# EAGLE design 8_R_G_B_LEDs (EAGLE 6.4)
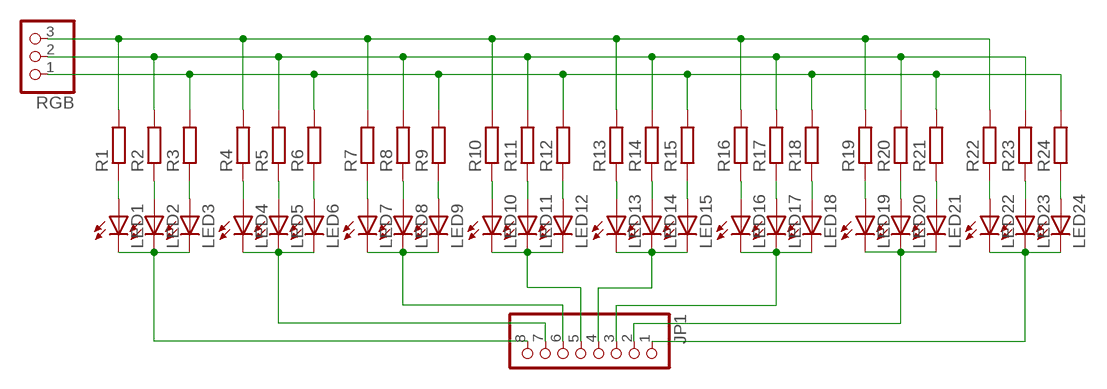
[diagram p0: schematic, sheet 1]

## Parts
JP1  PINHD-1X8  [1X08]
LED1  LED5MM  [LED5MM]
LED2  LED5MM  [LED5MM]
LED3  LED5MM  [LED5MM]
LED4  LED5MM  [LED5MM]
LED5  LED5MM  [LED5MM]
LED6  LED5MM  [LED5MM]
LED7  LED5MM  [LED5MM]
LED8  LED5MM  [LED5MM]
LED9  LED5MM  [LED5MM]
LED10  LED5MM  [LED5MM]
LED11  LED5MM  [LED5MM]
LED12  LED5MM  [LED5MM]
LED13  LED5MM  [LED5MM]
LED14  LED5MM  [LED5MM]
LED15  LED5MM  [LED5MM]
LED16  LED5MM  [LED5MM]
LED17  LED5MM  [LED5MM]
LED18  LED5MM  [LED5MM]
LED19  LED5MM  [LED5MM]
LED20  LED5MM  [LED5MM]
LED21  LED5MM  [LED5MM]
LED22  LED5MM  [LED5MM]
LED23  LED5MM  [LED5MM]
LED24  LED5MM  [LED5MM]
R1  R-EU_0207/7  [0207/7]
R2  R-EU_0207/7  [0207/7]
R3  R-EU_0207/7  [0207/7]
R4  R-EU_0207/7  [0207/7]
R5  R-EU_0207/7  [0207/7]
R6  R-EU_0207/7  [0207/7]
R7  R-EU_0207/7  [0207/7]
R8  R-EU_0207/7  [0207/7]
R9  R-EU_0207/7  [0207/7]
R10  R-EU_0207/7  [0207/7]
R11  R-EU_0207/7  [0207/7]
R12  R-EU_0207/7  [0207/7]
R13  R-EU_0207/7  [0207/7]
R14  R-EU_0207/7  [0207/7]
R15  R-EU_0207/7  [0207/7]
R16  R-EU_0207/7  [0207/7]
R17  R-EU_0207/7  [0207/7]
R18  R-EU_0207/7  [0207/7]
R19  R-EU_0207/7  [0207/7]
R20  R-EU_0207/7  [0207/7]
R21  R-EU_0207/7  [0207/7]
R22  R-EU_0207/7  [0207/7]
R23  R-EU_0207/7  [0207/7]
R24  R-EU_0207/7  [0207/7]
RGB  PINHD-1X3  [1X03]

## Nets
N$1: R1.2 R4.2 R7.2 R10.2 R13.2 R16.2 R19.2 R22.2 RGB.3
N$2: R2.2 R5.2 R8.2 R11.2 R14.2 R17.2 R20.2 R23.2 RGB.2
N$3: R3.2 R6.2 R9.2 R12.2 R15.2 R18.2 R21.2 R24.2 RGB.1
N$4: LED1.A R1.1
N$5: LED2.A R2.1
N$6: LED3.A R3.1
N$7: JP1.8 LED1.K(C) LED2.K(C) LED3.K(C)
N$8: JP1.7 LED4.K(C) LED5.K(C) LED6.K(C)
N$9: JP1.6 LED7.K(C) LED8.K(C) LED9.K(C)
N$10: JP1.5 LED10.K(C) LED11.K(C) LED12.K(C)
N$11: LED4.A R4.1
N$12: LED5.A R5.1
N$13: LED6.A R6.1
N$14: JP1.4 LED13.K(C) LED14.K(C) LED15.K(C)
N$15: JP1.3 LED16.K(C) LED17.K(C) LED18.K(C)
N$16: JP1.2 LED19.K(C) LED20.K(C) LED21.K(C)
N$17: JP1.1 LED22.K(C) LED23.K(C) LED24.K(C)
N$18: LED7.A R7.1
N$19: LED8.A R8.1
N$20: LED9.A R9.1
N$21: LED10.A R10.1
N$22: LED11.A R11.1
N$23: LED12.A R12.1
N$24: LED13.A R13.1
N$25: LED14.A R14.1
N$26: LED15.A R15.1
N$27: LED16.A R16.1
N$28: LED17.A R17.1
N$29: LED18.A R18.1
N$30: LED19.A R19.1
N$31: LED20.A R20.1
N$32: LED21.A R21.1
N$33: LED22.A R22.1
N$34: LED23.A R23.1
N$35: LED24.A R24.1

## Library data of the parts
JP1 = pinhead:PINHD-1X8: PIN HEADER
LED1-LED24 = led:LED: LED OSRAM: - CHIPLED LG R971, LG N971, LY N971, LG Q971, LY Q971, LO R971, LY R971 LH N974, LH R974 LS Q976, LO Q976, LY Q976 LO Q996 - Hyper CHIPLED LW Q18S LB Q993, LB Q99A, LB R99A - SideLED LS A670, LO A670, LY A670, LG A670, LP A670 LB A673, LV A673, LT A673, LW A673 LH A674 LY A675 LS A676, LA A676, LO A676, LY A676, LW A676 LS A679, LY A679, LG A679 - Hyper Micro SIDELED® LS Y876, LA Y876, LO Y876, LY Y876 LT Y87S - SmartLED LW L88C, LW L88S LB L89C, LB L89S, LG L890 LS L89K, LO L89K, LY L89K LS L896, LA L896, LO L896, LY L896 - TOPLED LS T670, LO T670, LY T670, LG T670, LP T670 LSG T670, LSP T670, LSY T670, LOP T670, LYG T670 LG T671, LOG T671, LSG T671 LB T673, LV T673, LT T673, LW T673 LH T674 LS T676, LA T676, LO T676, LY T676, LB T676, LH T676, LSB T676, LW T676 LB T67C, LV T67C, LT T67C, LS T67K, LO T67K, LY T67K, LW E67C LS E67B, LA E67B, LO E67B, LY E67B, LB E67C, LV E67C, LT E67C LW T67C LS T679, LY T679, LG T679 LS T770, LO T770, LY T770, LG T770, LP T770 LB T773, LV T773, LT T773, LW T773 LH T774 LS E675, LA E675, LY E675, LS T675 LS T776, LA T776, LO T776, LY T776, LB T776 LHGB T686 LT T68C, LB T68C - Hyper Mini TOPLED® LB M676 - Mini TOPLED Santana® LG M470 LS M47K, LO M47K, LY M47K Source: http://www.osram.convergy.de LUXEON: - LUMILED® LXK2-PW12-R00, LXK2-PW12-S00, LXK2-PW14-U00, LXK2-PW14-V00 LXK2-PM12-R00, LXK2-PM12-S00, LXK2-PM14-U00 LXK2-PE12-Q00, LXK2-PE12-R00, LXK2-PE12-S00, LXK2-PE14-T00, LXK2-PE14-U00 LXK2-PB12-K00, LXK2-PB12-L00, LXK2-PB12-M00, LXK2-PB14-N00, LXK2-PB14-P00, LXK2-PB14-Q00 LXK2-PR12-L00, LXK2-PR12-M00, LXK2-PR14-Q00, LXK2-PR14-R00 LXK2-PD12-Q00, LXK2-PD12-R00, LXK2-PD12-S00 LXK2-PH12-R00, LXK2-PH12-S00 LXK2-PL12-P00, LXK2-PL12-Q00, LXK2-PL12-R00 Source: www.luxeon.com KINGBRIGHT: KA-3528ASYC Source: www.kingbright.com
R1-R24 = rcl:R-EU_: RESISTOR, European symbol
RGB = pinhead:PINHD-1X3: PIN HEADER

## Board
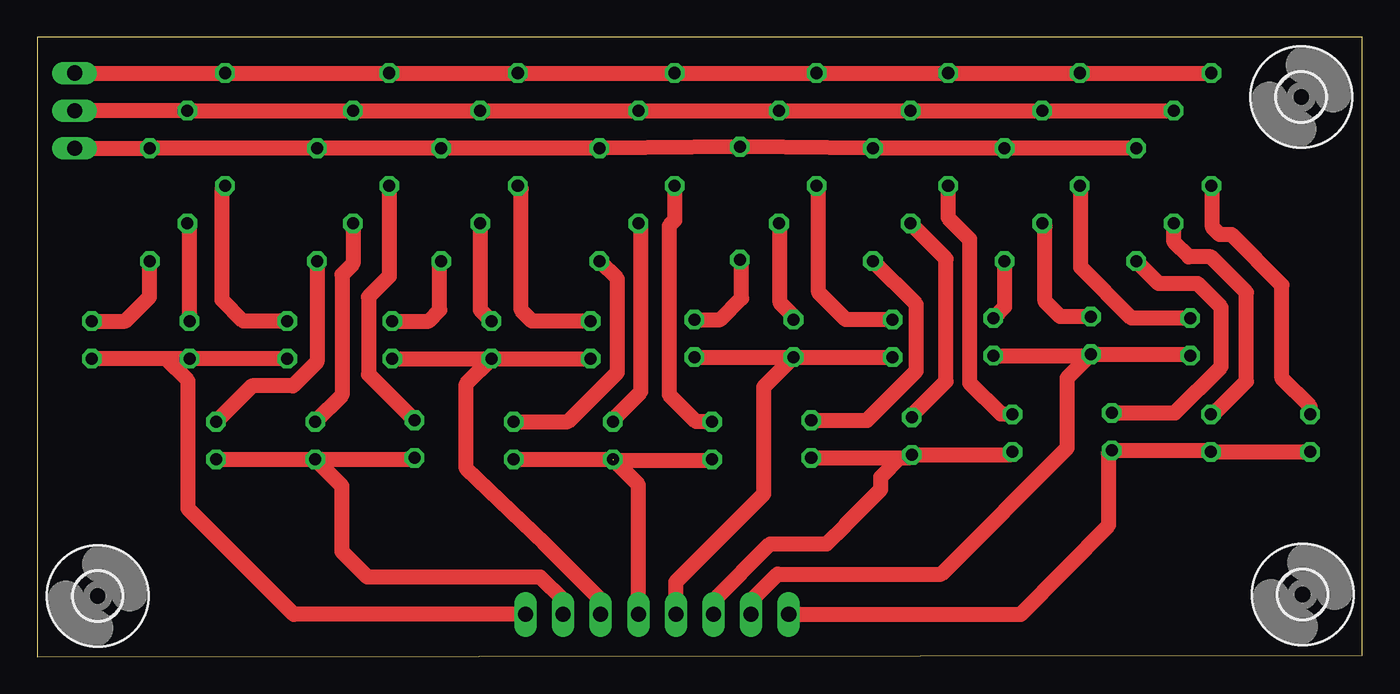
[diagram p1: board, top side]
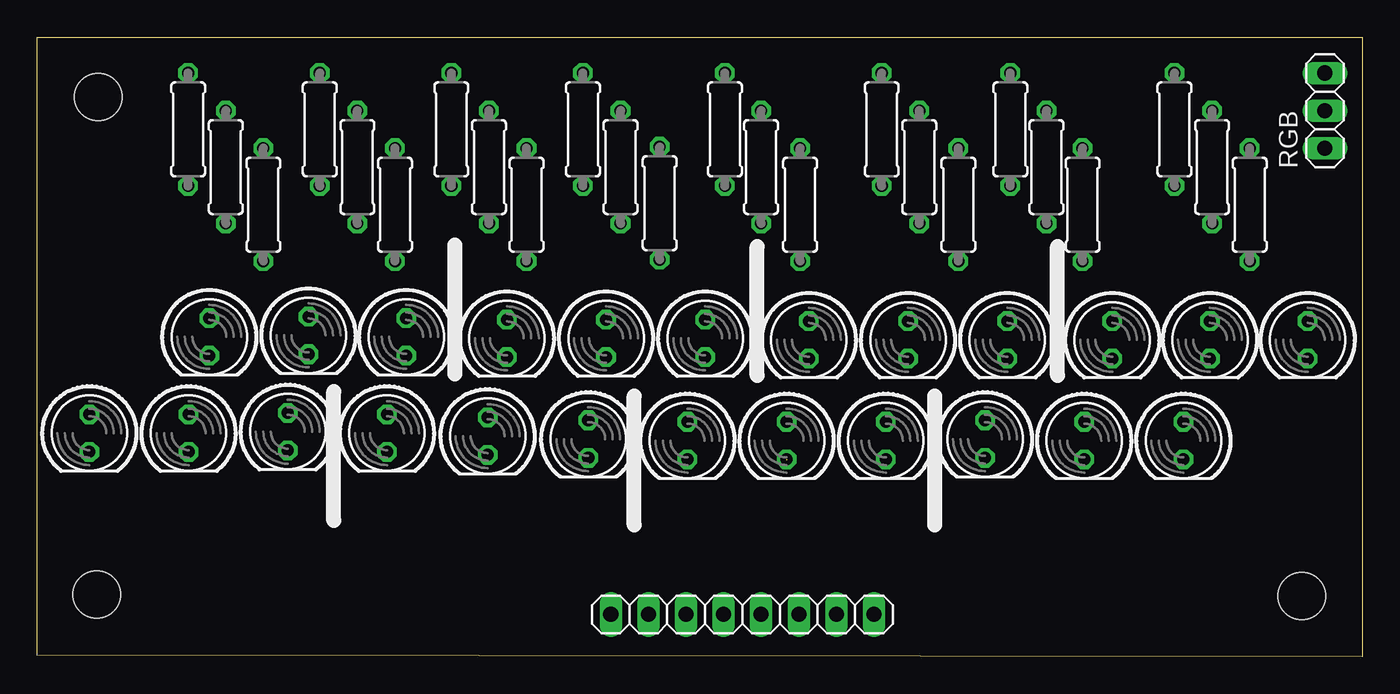
[diagram p2: board, bottom side, seen from below]

Size 89.54 x 41.85 mm. Coordinates in mm from the lower left corner, seen from the top.
Outline: 0,0 89.54,0.1 89.54,41.85 0,41.85 0,0
Copper layers (1*16): Top 0.035mm / dielectric 1.5mm / Bottom 0.035mm
Design rules "default": minimum track width 10mil, minimum drill 24mil, track to track 8mil, track to pad 8mil, pad to pad 8mil, via to via 8mil, smd to smd 8mil, copper to edge 40mil, drill to drill 8mil, minimum pad ring 10mil, minimum via ring 8mil, stop-mask expansion 4mil, vias tented up to drill 0mil, thermal gap 10mil

### Footprints (pad centres in the part's own frame; a part is rotated, then mirrored left to right if it is on the bottom)
1X08 = drill 1.016 long: 1 -8.89,0; 2 -6.35,0; 3 -3.81,0; 4 -1.27,0; 5 1.27,0; 6 3.81,0; 7 6.35,0; 8 8.89,0
LED5MM = drill 0.813 octagon: A -1.27,0; K 1.27,0
0207/7 = drill 0.813 octagon: 1 -3.81,0; 2 3.81,0
1X03 = drill 1.016 long: 1 -2.54,0; 2 0,0; 3 2.54,0
3,2 = hole 3.2: 0,0

### Placement (x,y rotation side)
JP1  41.89,2.86 0 bottom
LED1  16.9,21.4 270 bottom
LED2  10.3,21.4 270 bottom
LED3  3.7,21.4 270 bottom
LED4  25.5,14.7 270 bottom
LED5  18.8,14.6 270 bottom
LED6  12.1,14.6 270 bottom
LED7  37.4,21.4 270 bottom
LED8  30.7,21.4 270 bottom
LED9  24,21.4 270 bottom
LED10  45.6,14.6 270 bottom
LED11  38.9,14.6 270 bottom
LED12  32.2,14.6 270 bottom
LED13  57.8,21.5 270 bottom
LED14  51.1,21.5 270 bottom
LED15  44.4,21.5 270 bottom
LED16  65.9,15.1 270 bottom
LED17  59.1,14.9 270 bottom
LED18  52.3,14.7 270 bottom
LED19  77.9,21.6 270 bottom
LED20  71.2,21.7 270 bottom
LED21  64.6,21.6 270 bottom
LED22  86,15.1 270 bottom
LED23  79.3,15.1 270 bottom
LED24  72.6,15.2 270 bottom
R1  12.7,35.61 90 bottom
R2  10.16,33.07 90 bottom
R3  7.62,30.53 90 bottom
R4  23.79,35.61 90 bottom
R5  21.35,33.07 90 bottom
R6  18.91,30.53 90 bottom
R7  32.48,35.61 90 bottom
R8  29.94,33.07 90 bottom
R9  27.3,30.53 90 bottom
R10  43.07,35.61 90 bottom
R11  40.63,33.07 90 bottom
R12  37.99,30.53 90 bottom
R13  52.66,35.61 90 bottom
R14  50.12,33.07 90 bottom
R15  47.48,30.63 90 bottom
R16  61.55,35.61 90 bottom
R17  59.01,33.07 90 bottom
R18  56.47,30.53 90 bottom
R19  70.44,35.61 90 bottom
R20  67.9,33.07 90 bottom
R21  65.36,30.53 90 bottom
R22  79.33,35.61 90 bottom
R23  76.79,33.07 90 bottom
R24  74.25,30.53 90 bottom
RGB  2.54,36.88 90 bottom
U$1  [3,2]  4.1,4.1 0 top
U$2  [3,2]  85.5,4.2 0 top
U$3  [3,2]  85.4,37.8 0 top

### Tracks (layer width: path | path; a pad name or v marks a point on that pad's centre or on a via)
N$1
  Top 1.016: R22.2 R19.2 R16.2 R13.2 R10.2 R7.2 R4.2 R1.2 RGB.3
N$2
  Top 1.016: R23.2 R20.2 R17.2 R14.2 R11.2 R8.2 R5.2 R2.2 RGB.2
N$3
  Top 1.016: R24.2 R21.2 R18.2 R15.2 R12.2 R9.2 R6.2 R3.2 RGB.1
N$4
  Top 1.016: LED1.A 13.93,22.67 12.5,24.1 12.5,31.6 R1.1
N$5
  Top 1.016: LED2.A 10.3,29.12 R2.1
N$6
  Top 1.016: 7.62,26.59 R3.1 7.6,26.7 7.6,24.3 5.97,22.67 LED3.A
N$7
  Top 1.016: JP1.8 17.34,2.86 10.2,10 10.2,18.63 8.7,20.13 | LED1.K LED2.K 8.7,20.13 | 8.7,20.13 LED3.K
N$8
  Top 1.016: JP1.7 35.54,3.79 35.56,3.81 33.99,5.38 22.32,5.38 20.6,7.1 20.6,11.53 LED5.K | LED6.K LED5.K | LED5.K 25.4,13.33 LED4.K | 19,13.13 LED5.K
N$9
  Top 1.016: JP1.6 38.08,3.79 38.1,3.81 34.29,7.62 34.28,7.62 29,12.7 29,18.43 LED8.K | LED9.K LED8.K | LED8.K LED7.K
N$10  (1 unrouted)
  Top 1.016: JP1.5 40.62,11.61 LED11.K LED12.K | 38.9,13.26 45.53,13.26 LED10.K
N$11
  Top 1.016: R4.1 23.79,25.69 22.4,24.3 22.4,19.07 LED4.A
N$12
  Top 1.016: R5.1 21.35,26.55 20.6,25.8 20.6,17.67 LED5.A
N$13
  Top 1.016: R6.1 18.91,19.91 17.3,18.3 14.53,18.3 LED6.A
N$14
  Top 1.016: JP1.4 43.16,5.06 49.1,11 49.1,18.23 LED14.K | LED15.K LED14.K | LED14.K LED13.K
N$15
  Top 1.016: JP1.3 45.7,3.79 49.53,7.62 53.34,7.62 54.61,8.89 54.61,8.91 57,11.3 57,12.13 58.3,13.43 | LED18.K 58.3,13.43 | 58.3,13.43 58.9,13.43 LED17.K 65.7,13.63 LED16.K
N$16
  Top 1.016: JP1.2 48.24,3.79 50.03,5.58 61.08,5.58 69.6,14.1 69.6,18.83 LED20.K | LED21.K 71.1,20.33 LED20.K | LED20.K 77.8,20.43 LED19.K
N$17
  Top 1.016: JP1.1 66.46,2.86 72.39,8.89 72.39,13.72 LED24.K 79.2,13.93 LED23.K LED22.K
N$18
  Top 1.016: LED7.A 33.43,22.67 32.7,23.4 32.7,31.58 R7.1
N$19
  Top 1.016: R8.1 29.94,23.43 LED8.A
N$20
  Top 1.016: LED9.A 26.47,22.67 27.2,23.4 27.2,26.62 R9.1
N$21
  Top 1.016: R10.1 43.07,29.47 42.7,29.1 42.7,17.7 44.53,15.87 LED10.A
N$22
  Top 1.016: R11.1 40.8,29.09 40.8,17.9 38.9,16 LED11.A
N$23
  Top 1.016: R12.1 39.2,25.51 39.2,19.2 35.87,15.87 LED12.A
N$24
  Top 1.016: R13.1 52.8,31.66 52.8,24.6 54.63,22.77 LED13.A
N$25
  Top 1.016: R14.1 50.2,29.18 50.2,23.9 51.1,23 LED14.A
N$26
  Top 1.016: R15.1 47.6,26.7 47.6,24.2 46.17,22.77 LED15.A
N$27
  Top 1.016: R16.1 61.55,29.65 63,28.2 63,18.5 65.1,16.4 65.87,16.4 LED16.A
N$28
  Top 1.016: LED17.A 59.1,16.3 61.4,18.6 61.4,26.87 R17.1
N$29
  Top 1.016: LED18.A 56.07,15.97 59.4,19.3 59.4,23.79 R18.1
N$30
  Top 1.016: LED19.A 73.93,22.87 70.5,26.3 70.5,31.74 R19.1
N$31
  Top 1.016: LED20.A 69.13,22.97 68.1,24 68.1,29.06 R20.1
N$32
  Top 1.016: R21.1 65.36,23.63 LED21.A
N$33
  Top 1.016: LED22.A 86,16.9 84.1,18.8 84.1,25.1 80.7,28.5 79.9,28.5 79.4,29 79.4,31.73 R22.1
N$34
  Top 1.016: LED23.A 79.47,16.37 81.7,18.6 81.7,24.6 79.3,27 77.8,27 76.8,28 R23.1
N$35
  Top 1.016: LED24.A 76.87,16.47 80,19.6 80,23.6 78.4,25.2 75.77,25.2 R24.1